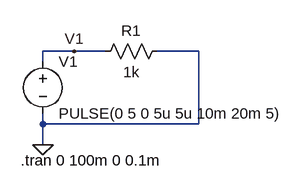
[diagram p0: schematic E3-Fuente-pulsante.asc]
E3-Fuente-pulsante.asc, the LTspice schematic file:
Version 4
SHEET 1 880 680
WIRE -1664 128 -1712 128
WIRE -1616 128 -1664 128
WIRE -1472 128 -1536 128
WIRE -1712 144 -1712 128
WIRE -1712 240 -1712 224
WIRE -1472 240 -1472 128
WIRE -1472 240 -1712 240
WIRE -1712 272 -1712 240
FLAG -1712 272 0
FLAG -1664 128 V1
SYMBOL res -1520 112 R90
WINDOW 0 0 56 VBottom 2
WINDOW 3 32 56 VTop 2
SYMATTR InstName R1
SYMATTR Value 1k
SYMATTR SpiceLine pwr=1
SYMBOL voltage -1712 128 R0
WINDOW 123 0 0 Left 0
WINDOW 39 0 0 Left 0
SYMATTR InstName V1
SYMATTR Value PULSE(0 5 0 5u 5u 10m 20m 5)
TEXT -1746 296 Left 2 !.tran 0 100m 0 0.1m

The netlist it stands for:
* E3-Fuente-pulsante.asc
R1 0 V1 1k pwr=1
V1 V1 0 PULSE(0 5 0 5u 5u 10m 20m 5)
.tran 0 100m 0 0.1m
.backanno
.end